# Altium schematic sheet DualDriverStepperRight.SchDoc
size A
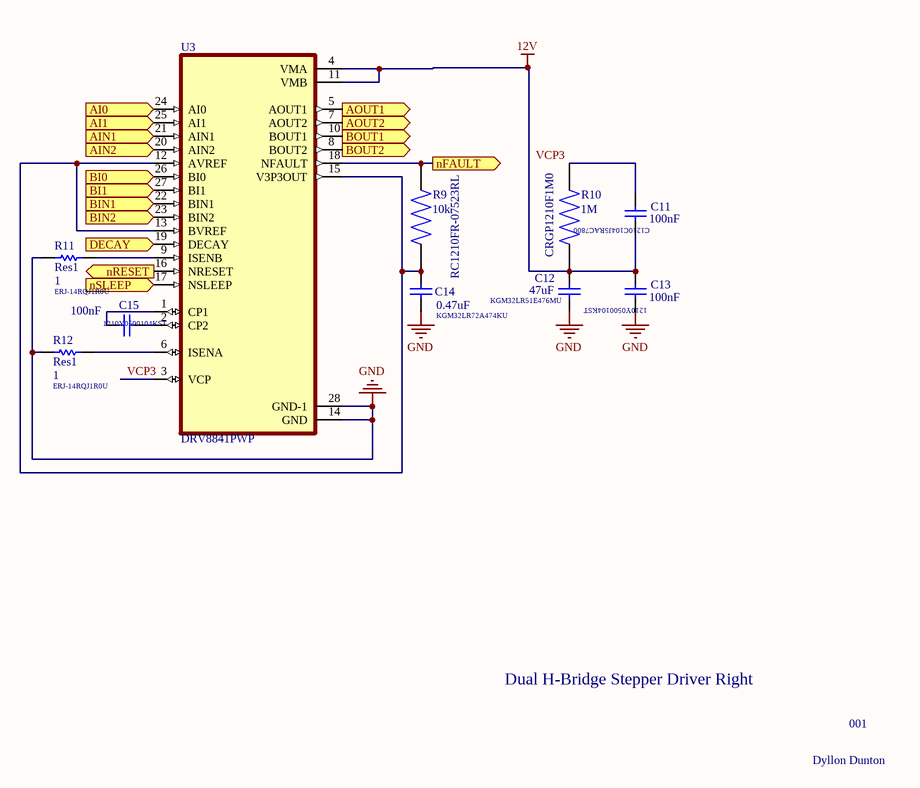
[diagram p0: DualDriverStepperRight.SchDoc]

## Parts
C11  value 100nF  [C1210]  (hidden comment: Cap)
C12  value 47uF  [C1210]  (hidden comment: Cap)
C13  value 100nF  [C1210]  (hidden comment: Cap)
C14  value 0.47uF  [C1210]  (hidden comment: Cap)
C15  value 100nF  [C1210]  (hidden comment: Cap)
R9  RC1210FR-07523RL  value 10k  [RESC3126X65N]
R10  CRGP1210F1M0  value 1M  [RESC3126X65N]
R11  Res1  value 1  [RES_ERJ14RQJ1R0U]
R12  Res1  value 1  [RES_ERJ14RQJ1R0U]
U3  DRV8841PWP  [IC_TPS61196PWPRQ1]

## Ports
AI0 (in), AI1 (in), AIN1 (in), AIN2 (in), AOUT1 (out), AOUT2 (out), BI0 (in), BI1 (in), BIN1 (in), BIN2 (in), BOUT1 (out), BOUT2 (out), DECAY (in), nFAULT (out), nRESET (in), nSLEEP (in)

## Nets
12V: C11.2 C12.2 C13.1 R10.1 U3.4(VMA) U3.11(VMB)
GND: C12.1 C13.2 C14.1 R11.1 R12.1 U3.14(GND) U3.28(GND-1)
AI0: U3.24(AI0) ; port AI0
AI1: U3.25(AI1) ; port AI1
AIN1: U3.21(AIN1) ; port AIN1
AIN2: U3.20(AIN2) ; port AIN2
AOUT1: U3.5(AOUT1) ; port AOUT1
AOUT2: U3.7(AOUT2) ; port AOUT2
BI0: U3.26(BI0) ; port BI0
BI1: U3.27(BI1) ; port BI1
BIN1: U3.22(BIN1) ; port BIN1
BIN2: U3.23(BIN2) ; port BIN2
BOUT1: U3.10(BOUT1) ; port BOUT1
BOUT2: U3.8(BOUT2) ; port BOUT2
DECAY: U3.19(DECAY) ; port DECAY
nFAULT: R9.2 U3.18(NFAULT) ; port nFAULT
nRESET: U3.16(NRESET) ; port nRESET
nSLEEP: U3.17(NSLEEP) ; port nSLEEP
VCP3: U3.3(VCP)
NetC11_1: C11.1 R10.2
NetC14_2: C14.2 R9.1 U3.12(AVREF) U3.13(BVREF) U3.15(V3P3OUT)
NetC15_1: C15.1 U3.2(CP2)
NetC15_2: C15.2 U3.1(CP1)
NetR11_2: R11.2 U3.9(ISENB)
NetR12_2: R12.2 U3.6(ISENA)

## Notes on the sheet
- (near C11) C1210C104J5RAC7800
- ERJ-14RQJ1R0U
- 1210Y0500104KST
- (near C14) KGM32LR72A474KU
- (near C12) KGM32LR51E476MU
- (near C13) 1210Y0500104KST
- (near R12) ERJ-14RQJ1R0U
- Dual H-Bridge Stepper Driver Right
- 001
- Dyllon Dunton
- Labels drawn without touching a wire or pin: VCP3

## Library data of the parts
C11-C15 = Cap: Capacitor; Published: 8-Jun-2000; LatestRevisionDate: 17-Jul-2002; LatestRevisionNote: Re-released for DXP Platform.; PackageReference: RAD-0.3; Publisher: Altium Limited; PackageDescription: Radial Cap, Thru-Hole; 2 Leads; 0.3 in Pin Spacing
R9 R10 = RC1210FR-07523RL: 523 Ohms Â±1% 0.5W, 1/2W Chip Resistor 1210 _3225 Metric_ Moisture Resistant Thick Film; MF: Yageo; Package: 3126 Yageo; Availability: Unavailable; MP: RC1210FR-07523RL; SnapEDA_Link: https://www.snapeda.com/parts/RC1210FR-07523RL/Yageo/view-part/1091979/?ref=snap; Price: None
R11 R12 = Res1: Resistor; Published: 8-Jun-2000; LatestRevisionDate: 17-Jul-2002; LatestRevisionNote: Re-released for DXP Platform.; PackageReference: AXIAL-0.3; Publisher: Altium Limited; PackageDescription: Axial Device, Thru-Hole; 2 Leads; 0.3 in Pin Spacing
U3 = DRV8841PWP: 45-V, 2.5-A bipolar stepper or dual H-bridge motor driver IC with current regulation and PWM control; MF: Texas Instruments; Value: *; SnapEDA_Link: https://www.snapeda.com/parts/DRV8841PWP/Texas+Instruments/view-part/?ref=snap; Check_prices: https://www.snapeda.com/parts/DRV8841PWP/Texas+Instruments/view-part/?ref=eda; Purchase-URL: https://pricing.snapeda.com/search/part/DRV8841PWP/?ref=eda; Availability: In Stock; Price: None; Package: HTSSOP-28 Texas Instruments; MP: DRV8841PWP